# EAGLE design logger - V2 (EAGLE 7.6.0)
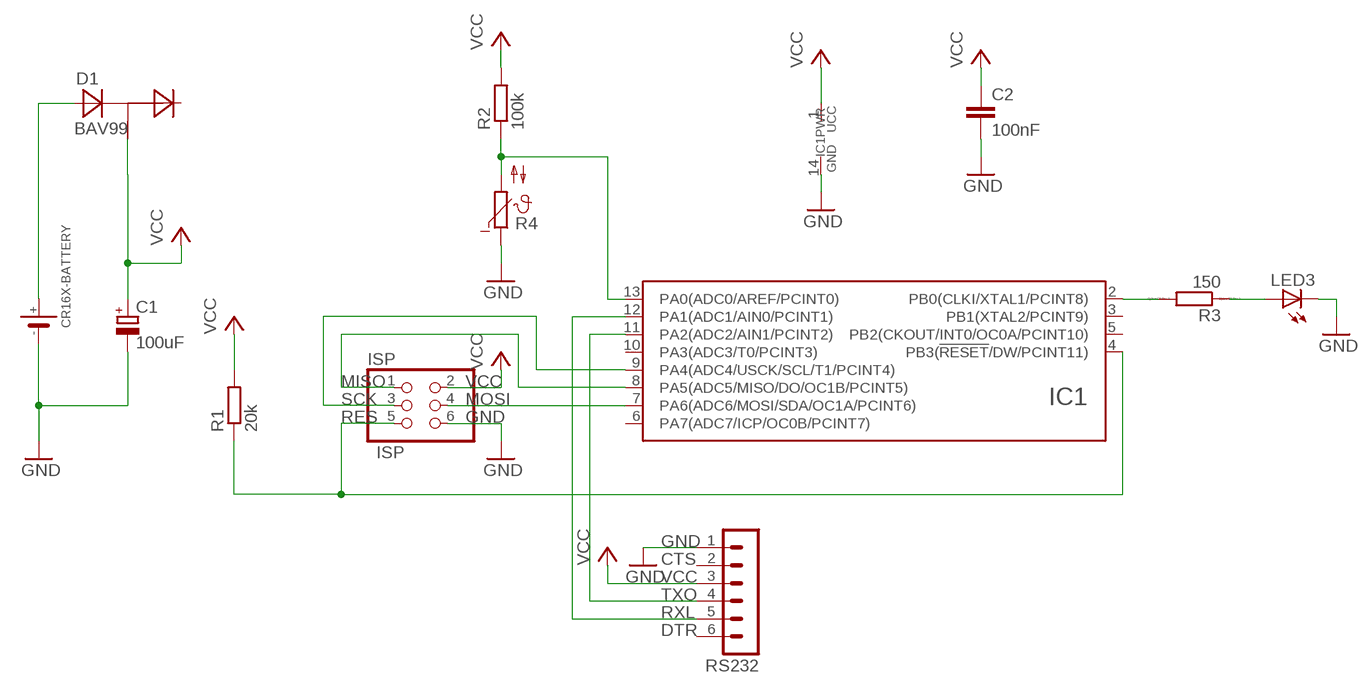
[diagram p0: schematic, sheet 1]

## Parts
C1  100uF  CPOL-EU153CLV-0505  [153CLV-0505]
C2  100nF  C-EUC1206K  [C1206K]
D1  BAV99  [SOT-23]
IC1  ATTINY24/44/84-SSU  [SOIC14]
ISP  PINHD-2X3  [2X03]
LED3  LED3MM  [LED3MM]
R1  20k  R-EU_R1206  [R1206]
R2  100k  R-EU_R1206  [R1206]
R3  150  RR1206  [R1206]
R4  NTC640  [P640]
RS232  MA06-1  [MA06-1]
U$1  CR16X-BATTERY  [16MM-BATTERY-HOLDER]

## Nets
D1: D1.3(A) U$1.P$2
GND: C1.- C2.2 IC1.14(GND) ISP.6 LED3.K(C) R4.1 RS232.1 U$1.P$1
MISO: IC1.8(PA5(ADC5/MISO/DO/OC1B/PCINT5)) ISP.1
MOSI: IC1.7(PA6(ADC6/MOSI/SDA/OC1A/PCINT6)) ISP.4
N$1: IC1.11(PA2(ADC2/AIN1/PCINT2)) RS232.4
N$2: IC1.13(PA0(ADC0/AREF/PCINT0)) R2.1 R4.2
N$19: LED3.A R3.1
N$32: IC1.12(PA1(ADC1/AIN0/PCINT1)) RS232.5
RES: IC1.4(PB3(!RESET!/DW/PCINT11)) ISP.5 R1.1
SCK: IC1.9(PA4(ADC4/USCK/SCL/T1/PCINT4)) ISP.3
V+: IC1.2(PB0(CLKI/XTAL1/PCINT8)) R3.2
VCC: C1.+ C2.1 D1.1(M) IC1.1(UCC) ISP.2 R1.2 R2.2 RS232.3
Unconnected: D1.2(C) IC1.3(PB1(XTAL2/PCINT9)) IC1.5(PB2(CKOUT/INT0/OC0A/PCINT10)) IC1.6(PA7(ADC7/ICP/OC0B/PCINT7)) IC1.10(PA3(ADC3/T0/PCINT3)) RS232.2 RS232.6

## Notes on the sheet
- ISP
- GND
- CTS
- VCC
- TXO
- RXL
- DTR

## Library data of the parts
C1 = rcl:CPOL-EU: POLARIZED CAPACITOR, European symbol
C2 = rcl:C-EU: CAPACITOR, European symbol
D1 = 0liver:BAV99
IC1 = atmel_tiny24-44-84tiny48-88mega48-88-168-328:ATTINY24/44/84; UCC: VCC
ISP = pinhead:PINHD-2X3: PIN HEADER
LED3 = led:LED: LED OSRAM: - CHIPLED LG R971, LG N971, LY N971, LG Q971, LY Q971, LO R971, LY R971 LH N974, LH R974 LS Q976, LO Q976, LY Q976 LO Q996 - Hyper CHIPLED LW Q18S LB Q993, LB Q99A, LB R99A - SideLED LS A670, LO A670, LY A670, LG A670, LP A670 LB A673, LV A673, LT A673, LW A673 LH A674 LY A675 LS A676, LA A676, LO A676, LY A676, LW A676 LS A679, LY A679, LG A679 - Hyper Micro SIDELED® LS Y876, LA Y876, LO Y876, LY Y876 LT Y87S - SmartLED LW L88C, LW L88S LB L89C, LB L89S, LG L890 LS L89K, LO L89K, LY L89K LS L896, LA L896, LO L896, LY L896 - TOPLED LS T670, LO T670, LY T670, LG T670, LP T670 LSG T670, LSP T670, LSY T670, LOP T670, LYG T670 LG T671, LOG T671, LSG T671 LB T673, LV T673, LT T673, LW T673 LH T674 LS T676, LA T676, LO T676, LY T676, LB T676, LH T676, LSB T676, LW T676 LB T67C, LV T67C, LT T67C, LS T67K, LO T67K, LY T67K, LW E67C LS E67B, LA E67B, LO E67B, LY E67B, LB E67C, LV E67C, LT E67C LW T67C LS T679, LY T679, LG T679 LS T770, LO T770, LY T770, LG T770, LP T770 LB T773, LV T773, LT T773, LW T773 LH T774 LS E675, LA E675, LY E675, LS T675 LS T776, LA T776, LO T776, LY T776, LB T776 LHGB T686 LT T68C, LB T68C - Hyper Mini TOPLED® LB M676 - Mini TOPLED Santana® LG M470 LS M47K, LO M47K, LY M47K Source: http://www.osram.convergy.de LUXEON: - LUMILED® LXK2-PW12-R00, LXK2-PW12-S00, LXK2-PW14-U00, LXK2-PW14-V00 LXK2-PM12-R00, LXK2-PM12-S00, LXK2-PM14-U00 LXK2-PE12-Q00, LXK2-PE12-R00, LXK2-PE12-S00, LXK2-PE14-T00, LXK2-PE14-U00 LXK2-PB12-K00, LXK2-PB12-L00, LXK2-PB12-M00, LXK2-PB14-N00, LXK2-PB14-P00, LXK2-PB14-Q00 LXK2-PR12-L00, LXK2-PR12-M00, LXK2-PR14-Q00, LXK2-PR14-R00 LXK2-PD12-Q00, LXK2-PD12-R00, LXK2-PD12-S00 LXK2-PH12-R00, LXK2-PH12-S00 LXK2-PL12-P00, LXK2-PL12-Q00, LXK2-PL12-R00 Source: www.luxeon.com KINGBRIGHT: KA-3528ASYC Source: www.kingbright.com
R1 R2 = rcl:R-EU_: RESISTOR, European symbol
R3 = eagle-ltspice:R: RESISTOR, European symbol; SPICEMODEL: NONE; SPICEPREFIX: R
R4 = ptc-ntc:NTC640: PHILIPS NTC; OC_FARNELL: unknown; OC_NEWARK: unknown
RS232 = con-lstb:MA06-1: PIN HEADER; OC_FARNELL: unknown; OC_NEWARK: unknown
U$1 = 0liver:CR16X-BATTERY

## Board
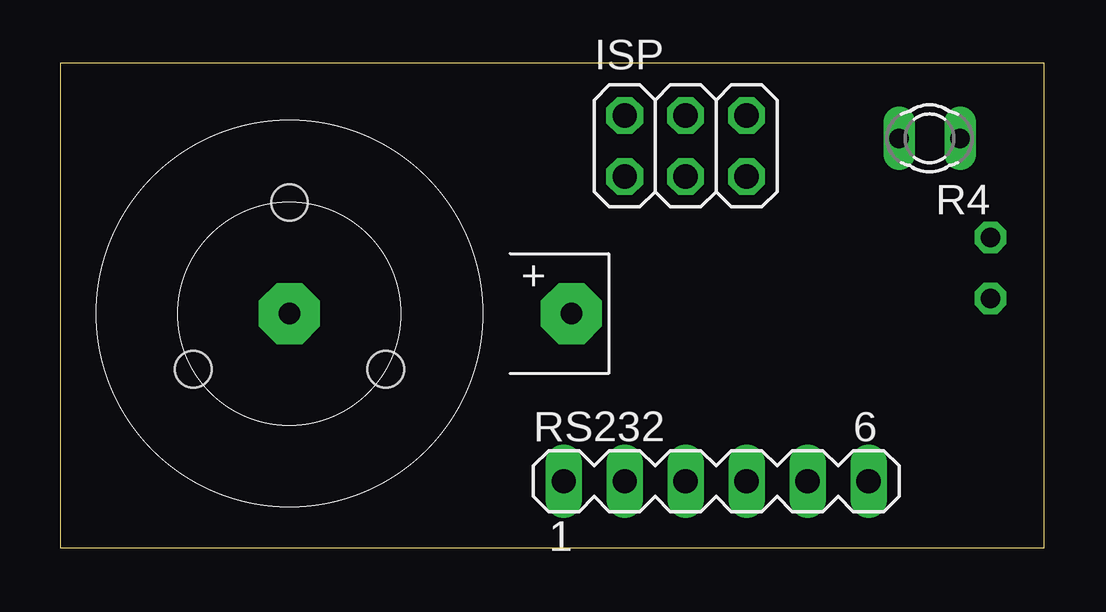
[diagram p1: board, top side]
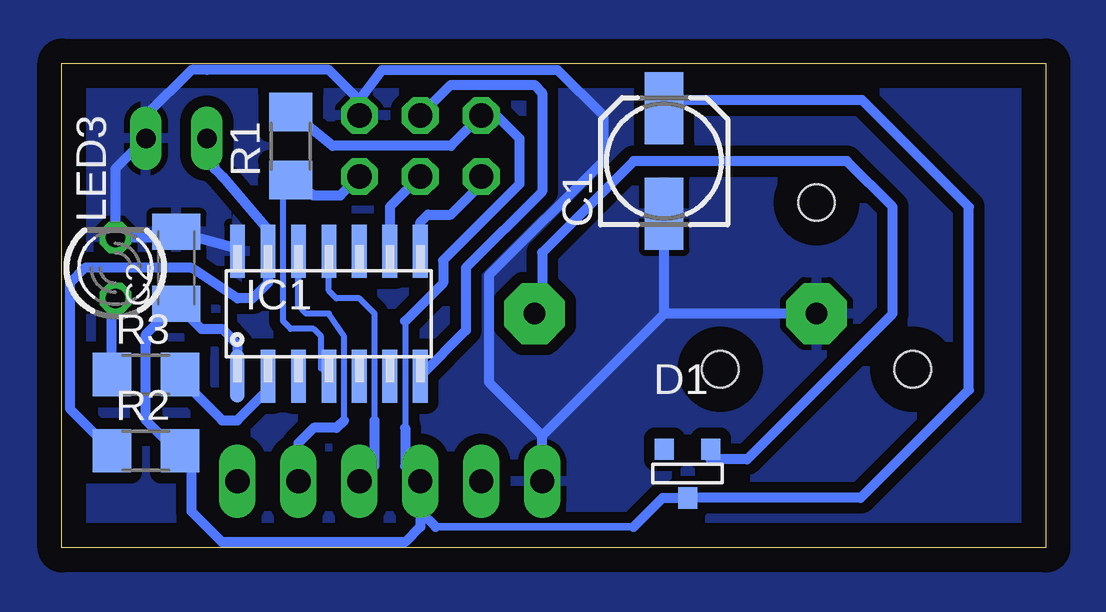
[diagram p2: board, bottom side, seen from below]

Size 41 x 20.2 mm. Coordinates in mm from the lower left corner, seen from the top.
Outline: 0,0 41,0 41,20.2 0,20.2 0,0
Copper layers (1*16): Top 0.035mm / dielectric 1.5mm / Bottom 0.035mm
Design rules "default *": minimum track width 10mil, minimum drill 24mil, track to track 18mil, track to pad 18mil, pad to pad 18mil, via to via 18mil, smd to smd 8mil, copper to edge 40mil, drill to drill 8mil, minimum pad ring 10mil, minimum via ring 8mil, stop-mask expansion 4mil, vias tented up to drill 0mil, thermal gap 10mil

### Footprints (pad centres in the part's own frame; a part is rotated, then mirrored left to right if it is on the bottom)
153CLV-0505 = smd 3 x 1.6: + 2.2,0; - -2.2,0
C1206K = smd 1.5 x 2: 1 -1.5,0; 2 1.5,0
SOT-23 = smd 0.787 x 0.889: 1 0.025,-1.016; 2 -0.94,1.016; 3 0.991,1.016
SOIC14 = smd 0.61 x 2.21: 1 -3.81,-2.603; 2 -2.54,-2.603; 3 -1.27,-2.603; 4 0,-2.603; 5 1.27,-2.603; 6 2.54,-2.603; 7 3.81,-2.603; 8 3.81,2.603; 9 2.54,2.603; 10 1.27,2.603; 11 0,2.603; 12 -1.27,2.603; 13 -2.54,2.603; 14 -3.81,2.603
2X03 = drill 1.016 octagon: 1 -2.54,-1.27; 2 -2.54,1.27; 3 0,-1.27; 4 0,1.27; 5 2.54,-1.27; 6 2.54,1.27
LED3MM = drill 0.813 octagon: A -1.27,0; K 1.27,0
R1206 = smd 1.6 x 1.803: 1 -1.422,0; 2 1.422,0
P640 = drill 0.813 long: 1 -1.27,0; 2 1.27,0
MA06-1 = drill 1.016 long: 1 -6.35,0; 2 -3.81,0; 3 -1.27,0; 4 1.27,0; 5 3.81,0; 6 6.35,0
16MM-BATTERY-HOLDER = drill 0.9 pad 2.54 octagon: P$1 0,0; P$2 11.75,0 | hole 1.52: 4.01,-2.315; -4.01,-2.315; 0,4.63

### Placement (x,y rotation side)
C1  15.91,16.11 90 bottom
C2  36.23,11.66 90 bottom
D1  14.96,3.09 0 bottom
IC1  29.88,9.76 0 bottom
ISP  26.07,16.75 0 top
LED3  38.77,11.66 90 bottom
R1  31.47,16.75 90 bottom
R2  37.5,4.04 0 bottom
R3  37.5,7.22 0 bottom
R4  36.23,17.06 180 top
RS232  27.34,2.77 0 top
U$1  9.56,9.76 0 top

### Tracks (layer width: path | path; a pad name or v marks a point on that pad's centre or on a via)
D1
  Bottom 0.406: U$1.P$2 20.99,10.08 20.99,12.3 17.18,16.11 8.29,16.11 6.39,14.21 6.39,9.76 12.46,3.69 13.97,3.69 D1.3
FILL
  pour Bottom: -4.6,23.6 49.3,23.92 49.3,-4.08 -4.6,-4.4
GND
  Bottom 0.406: IC1.14 33.86,12.53 C2.2 36.63,13.57 37.27,12.94 LED3.K 38.77,15.79 R4.1 37.5,18.02 35.59,19.92 34.96,19.92 29.88,19.92 28.61,18.65 | 28.61,18.65 ISP.6 28.61,18.65 | RS232.1 20.99,4.68 | 20.99,4.68 15.91,9.76 | 15.91,9.76 C1.- | U$1.P$1 15.91,9.76 | 28.61,18.65 27.66,19.92 20.35,19.92 18.45,18.02 18.45,16.11 23.21,11.35 23.21,6.9 20.99,4.68
  pour Bottom: -2.6,-0.4 -2.6,21.6 43.4,21.6 43.4,-2.4 -2.6,-2.4
MISO
  Bottom 0.406: IC1.8 26.07,13.57 25.75,13.89 24.8,13.89 23.53,15.16 ISP.1
MOSI
  Bottom 0.406: ISP.4 24.8,19.29 21.31,19.29 20.99,18.97 20.99,14.84 24.16,11.66 24.16,9.06 IC1.7
N$1
  Bottom 0.254: 27.97,5.31 27.97,9.76 28.61,10.39 29.56,10.39 29.88,10.71 IC1.11
  Bottom 0.406: RS232.4 27.97,3.41 27.97,5.31
N$2
  Bottom 0.406: 34.32,15.47 34.64,15.79 | 34.64,15.79 34.32,15.47 | 34.32,15.47 32.42,13.25 IC1.13 32.42,11.03 | 32.42,11.03 33.05,10.39 | 33.05,10.39 33.69,10.39 35.59,11.66 40.04,11.66 40.67,11.03 40.67,5.8 R2.1 | 32.42,11.03 33.05,10.39 | R4.2 34.64,15.79
N$19
  Bottom 0.406: R3.1 38.92,10.24 LED3.A
N$32
  Bottom 0.254: 29.24,5.31 29.24,8.81 29.88,9.76 30.83,9.76 31.15,10.08 IC1.12
  Bottom 0.406: 29.24,5.31 29.56,5 30.51,5 31.15,4.36 RS232.5
RES
  Bottom 0.254: IC1.4 30.2,7.47 30.2,8.81 30.51,9.12 31.47,9.12 31.78,9.44 31.78,14.84 32.25,15.32 R1.1
  Bottom 0.406: R1.1 30.51,14.69 29.4,14.69 ISP.5
SCK
  Bottom 0.406: ISP.3 27.34,14.21 27.34,13.25 IC1.9
V+
  Bottom 0.406: R3.2 36.08,7.07 34.32,5.31 33.69,5.31 32.42,6.58 IC1.2
VCC
  Bottom 0.254: 26.7,9.44 26.7,5
  Bottom 0.305: 25.43,0.87 17.18,0.87
  Bottom 0.406: R1.2 29.73,16.75 24.8,16.75 ISP.2 22.89,18.02 21.94,17.06 21.94,15.16 25.12,11.98 25.12,11.03 26.7,9.44 | C1.+ 15.57,18.65 7.66,18.65 3.21,14.21 3.21,6.58 7.02,2.77 7.72,2.08 D1.1 15.97,2.08 17.18,0.87 | RS232.3 26.07,1.5 25.43,0.87 | RS232.3 26.07,0.87 26.7,0.23 34.32,0.23 35.59,1.5 35.59,3.56 R2.2 36.23,4.04 37.5,5.31 37.5,8.49 37.5,8.89 C2.1 35.19,9.12 34.32,9.12 33.69,8.49 IC1.1 | 26.7,5 26.7,3.41 RS232.3

### Text on the board
Bottom: Temperatur Logger V2.0 10/2016